# Altium project Internal Power board.PrjPcb
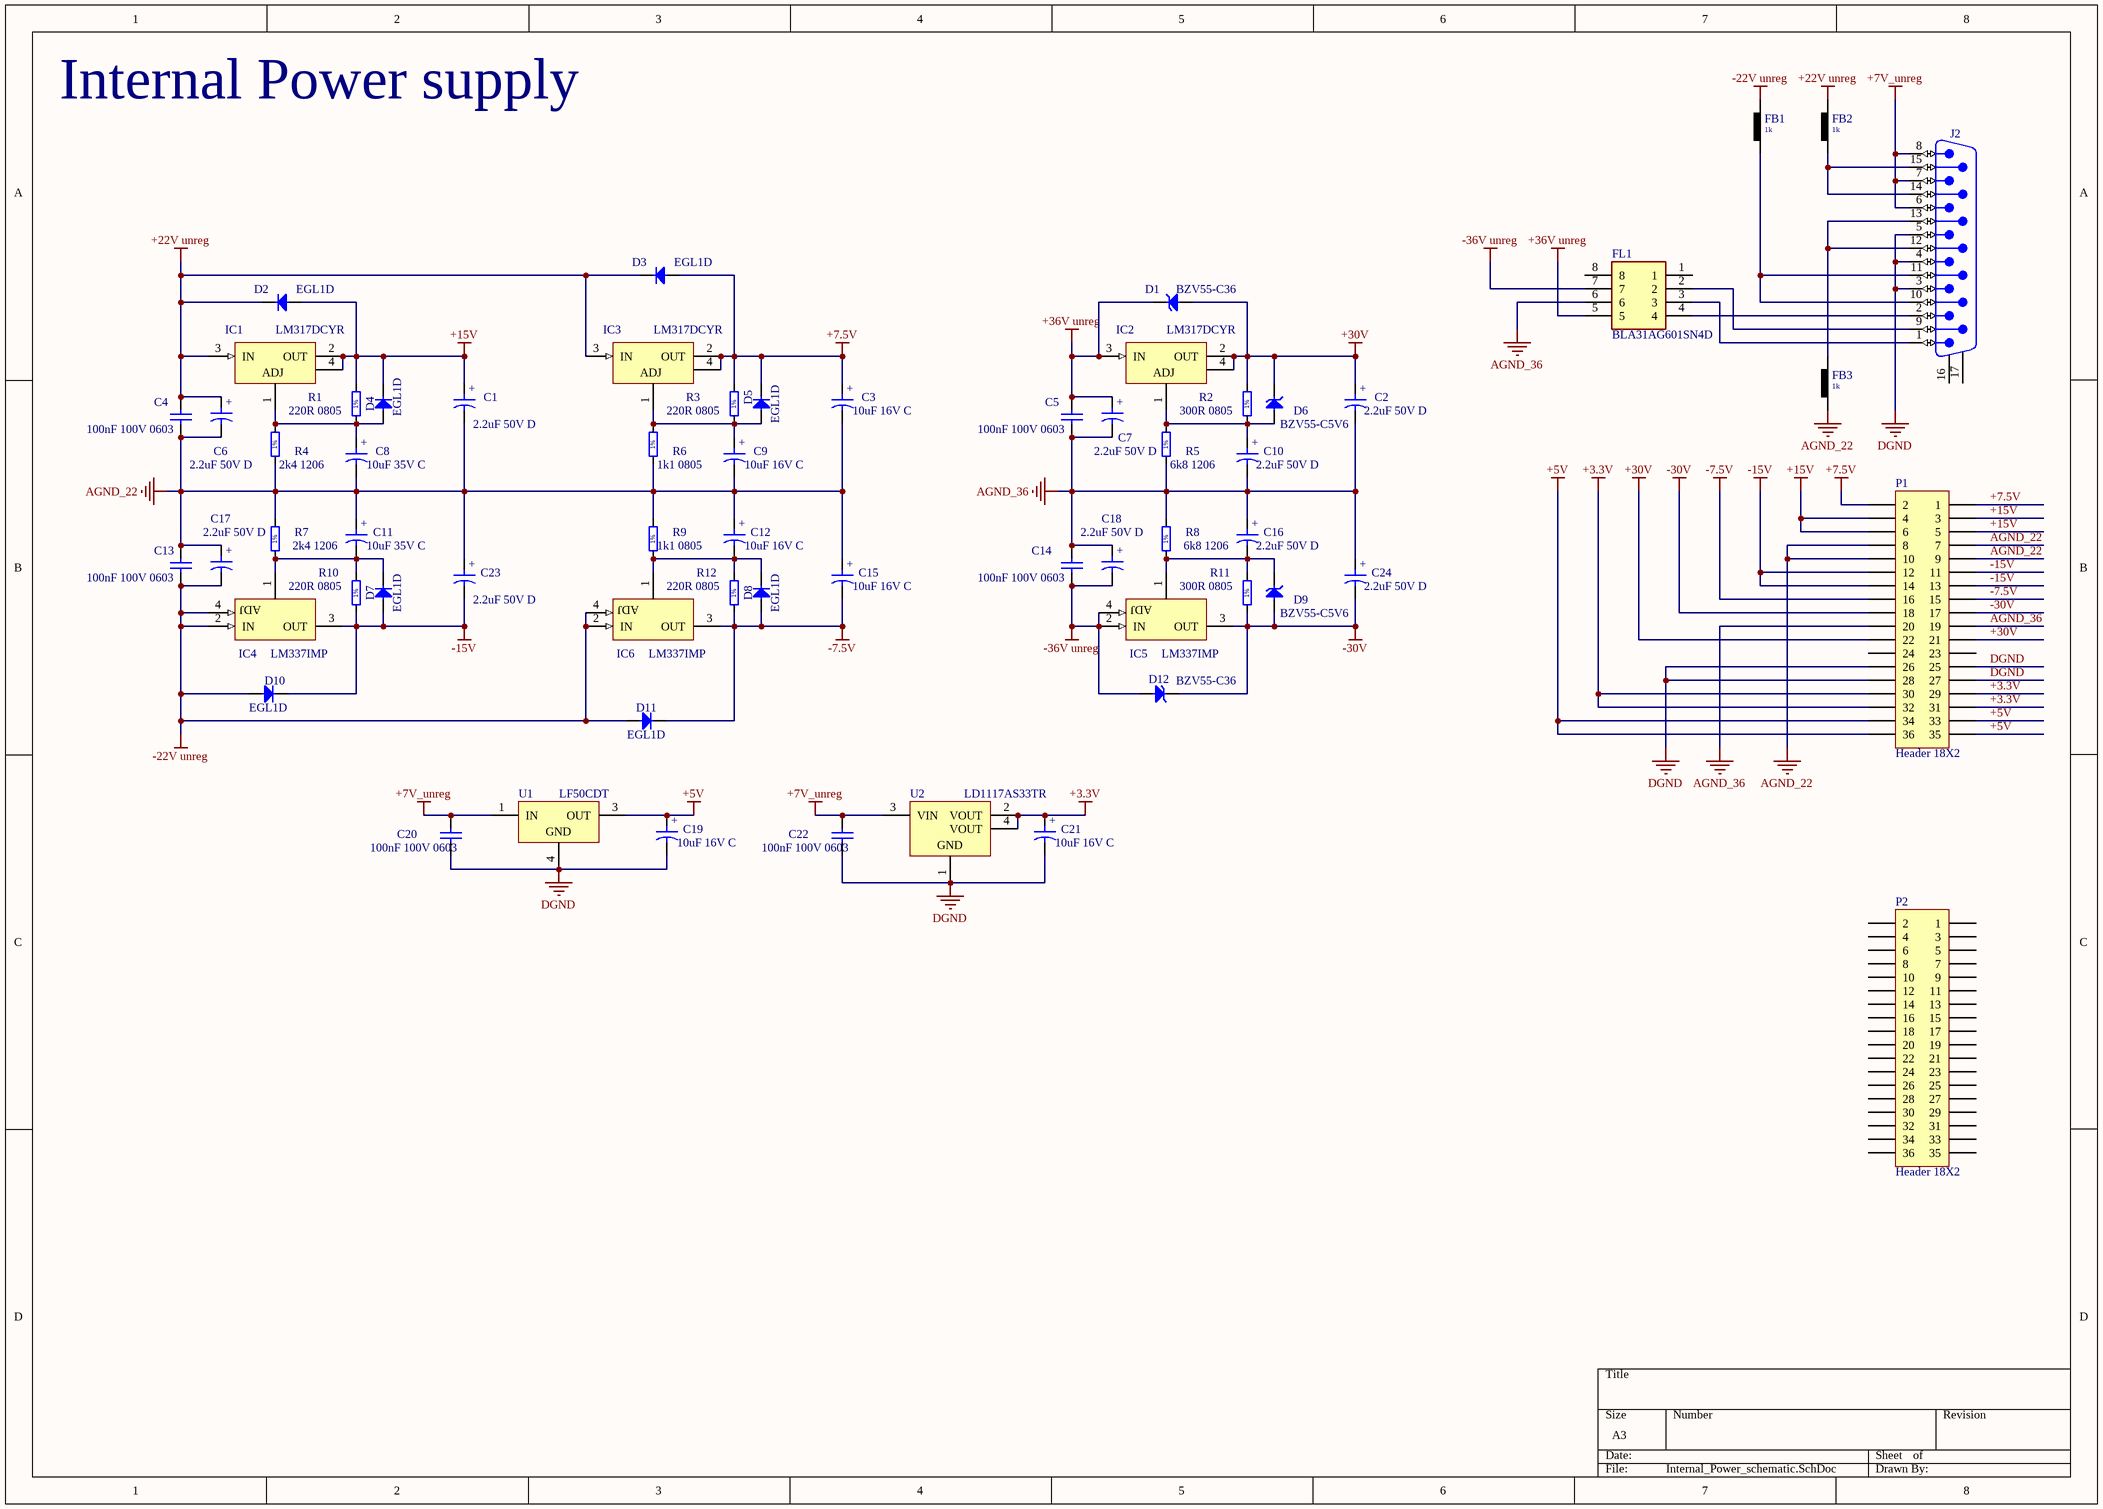
[diagram p0: Internal_Power_schematic.SchDoc]
1 sheet, 63 parts. Net scope: global (net labels, ports and power ports of the same name join across sheets).
Board file: Internal_Power_PCB.PcbDoc

## Sheet Internal_Power_schematic.SchDoc
size A3

### Parts
C1  2.2uF 50V D  [CAPMP7343X310N]
C2  2.2uF 50V D  [CAPMP7343X310N]
C3  10uF 16V C  [CAPMP6032X280N]
C4  100nF 100V 0603  [1608[0603]_CAP]
C5  100nF 100V 0603  [1608[0603]_CAP]
C6  2.2uF 50V D  [CAPMP7343X310N]
C7  2.2uF 50V D  [CAPMP7343X310N]
C8  10uF 35V C  [CAPMP6032X280N]
C9  10uF 16V C  [CAPMP6032X280N]
C10  2.2uF 50V D  [CAPMP7343X310N]
C11  10uF 35V C  [CAPMP6032X280N]
C12  10uF 16V C  [CAPMP6032X280N]
C13  100nF 100V 0603  [1608[0603]_CAP]
C14  100nF 100V 0603  [1608[0603]_CAP]
C15  10uF 16V C  [CAPMP6032X280N]
C16  2.2uF 50V D  [CAPMP7343X310N]
C17  2.2uF 50V D  [CAPMP7343X310N]
C18  2.2uF 50V D  [CAPMP7343X310N]
C19  10uF 16V C  [CAPMP6032X280N]
C20  100nF 100V 0603  [1608[0603]_CAP]
C21  10uF 16V C  [CAPMP6032X280N]
C22  100nF 100V 0603  [1608[0603]_CAP]
C23  2.2uF 50V D  [CAPMP7343X310N]
C24  2.2uF 50V D  [CAPMP7343X310N]
D1  BZV55-C36  [DIOMELF3515N]
D2  EGL1D  [DIOMELF3515N]
D3  EGL1D  [DIOMELF3515N]
D4  EGL1D  [DIOMELF3515N]
D5  EGL1D  [DIOMELF3515N]
D6  BZV55-C5V6  [DIOMELF3515N]
D7  EGL1D  [DIOMELF3515N]
D8  EGL1D  [DIOMELF3515N]
D9  BZV55-C5V6  [DIOMELF3515N]
D10  EGL1D  [DIOMELF3515N]
D11  EGL1D  [DIOMELF3515N]
D12  BZV55-C36  [DIOMELF3515N]
FB1  1k  [FB1206]
FB2  1k  [FB1206]
FB3  1k  [FB1206]
FL1  BLA31AG601SN4D  [BLA31AG102SN4D]
IC1  LM317DCYR  [SOT230P700X180-4N]
IC2  LM317DCYR  [SOT230P700X180-4N]
IC3  LM317DCYR  [SOT230P700X180-4N]
IC4  LM337IMP  [SOT230P700X180-4N]
IC5  LM337IMP  [SOT230P700X180-4N]
IC6  LM337IMP  [SOT230P700X180-4N]
J2  D-Sub  [DB15_PCB_AL;UMINIUM]  (value not drawn)
P1  Header 18X2  [18x2 header aluminium]
P2  Header 18X2  [18x2 header aluminium]
R1  220R 0805  [RESC2012X60N]
R2  300R 0805  [RESC2012X60N]
R3  220R 0805  [RESC2012X60N]
R4  2k4 1206  [RESC3216X65N]
R5  6k8 1206  [RESC3216X65N]
R6  1k1 0805  [RESC2012X60N]
R7  2k4 1206  [RESC3216X65N]
R8  6k8 1206  [RESC3216X65N]
R9  1k1 0805  [RESC2012X60N]
R10  220R 0805  [RESC2012X60N]
R11  300R 0805  [RESC2012X60N]
R12  220R 0805  [RESC2012X60N]
U1  LF50CDT  [TO-252]
U2  LD1117AS33TR  [SOT-223_N]

### Nets
+3.3V: C21.1 P1.29 P1.30 P1.31 P1.32 U2.2(VOUT) U2.4(VOUT)
+5V: C19.1 P1.33 P1.34 P1.35 P1.36 U1.3(OUT)
+7.5V: C3.1 D3.2(A) D5.1(C) IC3.2(OUT) IC3.4(OUT) P1.1 P1.2 R3.2
+7V_unreg: C20.1 C22.1 J2.6 J2.7 J2.8 U1.1(IN) U2.3(VIN)
+15V: C1.1 D2.2(A) D4.1(C) IC1.2(OUT) IC1.4(OUT) P1.3 P1.4 P1.5 P1.6 R1.2
+22V unreg: C4.1 C6.1 D2.1(C) D3.1(C) FB2.2 IC1.3(IN) IC3.3(IN)
+30V: C2.1 D1.2(A) D6.1(C) IC2.2(OUT) IC2.4(OUT) P1.21 P1.22 R2.2
+36V unreg: C5.1 C7.1 D1.1(C) FL1.5 IC2.3(IN)
-7.5V: C15.2 D8.2(A) D11.1(C) IC6.3(OUT) P1.15 P1.16 R12.1
-15V: C23.2 D7.2(A) D10.1(C) IC4.3(OUT) P1.11 P1.12 P1.13 P1.14 R10.1
-22V unreg: C13.2 C17.2 D10.2(A) D11.2(A) FB1.2 IC4.2(IN) IC4.4(IN) IC6.2(IN) IC6.4(IN)
-30V: C24.2 D9.2(A) D12.1(C) IC5.3(OUT) P1.17 P1.18 R11.1
-36V unreg: C14.2 C18.2 D12.2(A) FL1.7 IC5.2(IN) IC5.4(IN)
AGND_22: C1.2 C3.2 C4.2 C6.2 C8.2 C9.2 C11.1 C12.1 C13.1 C15.1 C17.1 C23.1 FB3.1 P1.7 P1.8 P1.9 P1.10 R4.1 R6.1 R7.2 R9.2
AGND_36: C2.2 C5.2 C7.2 C10.2 C14.1 C16.1 C18.1 C24.1 FL1.6 P1.19 P1.20 R5.1 R8.2
DGND: C19.2 C20.2 C21.2 C22.2 J2.3 J2.4 J2.5 P1.25 P1.26 P1.27 P1.28 U1.4(GND) U2.1(GND)
NetC8_1: C8.1 D4.2(A) IC1.1(ADJ) R1.1 R4.2
NetC9_1: C9.1 D5.2(A) IC3.1(ADJ) R3.1 R6.2
NetC10_1: C10.1 D6.2(A) IC2.1(ADJ) R2.1 R5.2
NetC11_2: C11.2 D7.1(C) IC4.1(ADJ) R7.1 R10.2
NetC12_2: C12.2 D8.1(C) IC6.1(ADJ) R9.1 R12.2
NetC16_2: C16.2 D9.1(C) IC5.1(ADJ) R8.1 R11.2
NetFB1_1: FB1.1 J2.10 J2.11
NetFB2_1: FB2.1 J2.14 J2.15
NetFB3_2: FB3.2 J2.12 J2.13
NetFL1_2: FL1.2 J2.9
NetFL1_3: FL1.3 J2.1
NetFL1_4: FL1.4 J2.2

Not connected (* = marked no-connect by the designer): FL1 1 8; J2 16 17; P1 23 24; P2 1 2 3 4 5 6 7 8 9 10 11 12 13 14 15 16 17 18 19 20 21 22 23 24 25 26 27 28 29 30 31 32 33 34 35 36

### Notes on the sheet
- Internal Power supply
- (in symbol CTE6032-28_10UF_25V_10%_LESR0500) +
- (in symbol CTE7343-31_22UF_35V_20%_LESR0400) +
- (in symbol R0805_1K1_1%_0.125W_100PPM) 1%
- (in symbol R0805_220R_1%_0.125W_100PPM) 1%
- (in symbol R1206_2K4_1%_0.25W_100PPM) 1%

### Library data of the parts
C1 C2 C6 C7 C10 C16-C18 C23 C24 = CTE7343-31_22UF_35V_20%_LESR0400: Polarised capacitor; Part Description: Low ESR 0R4 Solid Tantalum Chip Capacitor; Manufacturer: GENERIC; Manufacturer1 Part Number: TPSD226M035R0400; Voltage: 35V; Tolerance: ±20%; Part Number: CTE7343-31_22UF_35V_20%_LESR0400; Component Kind: Standard; Component Type: Standard; Pin Count: 2; Value: 2.2uF 50V D; Status: None; Manufacturer Part Number: CTE7343-31_22UF_35V_20%_LESR0400; Case: D; Mounted: Yes; Socket: No; SMD: Yes; Sense: No; Manufacturer1 Example: AVX; Manufacturer1 ComponentHeight: 3.1mm; HelpURL: \\cern.ch\dfs\Applications\Altium\Datasheets\CTE-LESR_AVX_TPS.pdf; Author: CERN DEM MR; CreateDate: 19.05.2016; LatestRevisionDate: 19.05.2016
C3 C8 C9 C11 C12 C15 C19 C21 = CTE6032-28_10UF_25V_10%_LESR0500: Polarised capacitor; Part Description: Low ESR 0R5 Solid Tantalum Chip Capacitor; Manufacturer: GENERIC; Manufacturer1 Part Number: TPSC106K025R0500; Voltage: 25V; Tolerance: ±10%; Part Number: CTE6032-28_10UF_25V_10%_LESR0500; Component Kind: Standard; Component Type: Standard; Pin Count: 2; Status: Preferred; Manufacturer Part Number: CTE6032-28_10UF_25V_10%_LESR0500; Case: C; Mounted: Yes; Socket: No; SMD: Yes; Sense: No; Manufacturer1 Example: AVX; Manufacturer1 ComponentHeight: 2.8mm; HelpURL: \\cern.ch\dfs\Applications\Altium\Datasheets\CTE-LESR_AVX_TPS.pdf; Author: CERN DEM JLC; CreateDate: 05.05.2008; LatestRevisionDate: 20.01.2009
  C3 C9 C12 C15 C19 C21: Value: 10uF 16V C
  C8 C11: Value: 10uF 35V C
C4 C5 C13 C14 C20 C22 = Cap Semi: Capacitor (Semiconductor SIM Model); Order: GRM31CR71A475KA01L; Published: 8-Jun-2000; LatestRevisionDate: 29-May-2009; LatestRevisionNote: IPC-7351 Footprint Added.; PackageReference: C1206; Publisher: Altium Limited; PackageDescription: Chip Capacitor; Value: 100nF 100V 0603
D1 D6 D9 D12 = BZV55-C12: Zener Diode; Part Description: Voltage Regulator Diode; Manufacturer: NXP SEMICONDUCTORS; Voltage: 12V; Power: 500mW; PressFit: No; Bonding: No; Part Number: BZV55-C12; Component Kind: Standard; Component Type: Standard; PackageDescription: SOD80C, MELF Diode, 2-Leads, Body 3.5x1.5mm, IPC Medium Density; Manufacturer Part Number: BZV55-C12; Pin Count: 2; Case: SOD-80C; Mounted: Yes; Socket: No; SMD: Yes; Sense: No; ComponentHeight: 1.6mm; HelpURL: \\cern.ch\dfs\Applications\Altium\Datasheets\BZV55.pdf; Author: CERN DEM MR; CreateDate: 19.05.2016; LatestRevisionDate: 19.05.2016
  D1 D12: Device: BZV55-C36
  D6 D9: Device: BZV55-C5V6
D2-D5 D7 D8 D10 D11 = PMLL4148L: Diode; Part Description: High-speed switching diodes; Manufacturer: NXP SEMICONDUCTORS; Voltage: 75V; Power: 200mA; PressFit: No; Bonding: No; Part Number: PMLL4148L; Component Kind: Standard; Component Type: Standard; Device: EGL1D; PackageDescription: SOD80C, MELF Diode, 2-Leads, Body 3.5x1.5mm, IPC Medium Density; Status: Not recommended; Manufacturer Part Number: PMLL4148L; Pin Count: 2; Case: SOD-80C; Mounted: Yes; Socket: No; SMD: Yes; Sense: No; ComponentHeight: 1.6mm; HelpURL: \\cern.ch\dfs\Applications\Altium\Datasheets\PMLL4148L.pdf; Author: CERN DEM JLC; CreateDate: 30.03.2009; LatestRevisionDate: 09.12.2009
FB1-FB3 = Chip FB BLM31P: 1206 1.5A 0.08ohm; Value: 1u; Price: 0.16
FL1 = BLA31AG601SN4D: Filter; Manufacturer_Name: Murata Electronics; Datasheet Link: https://www.murata.com/en-us/products/productdetail?partno=BLA31AG601SN4%23; Height: 1mm; Manufacturer_Part_Number: BLA31AG601SN4D; Mouser Part Number: 81-BLA3216A601SG4; Mouser Price/Stock: https://www.mouser.co.uk/ProductDetail/Murata-Electronics/BLA31AG601SN4D?qs=2ahBf5rJw09FDcUVkQibEg%3D%3D; Arrow Part Number: BLA31AG601SN4D; Arrow Price/Stock: https://www.arrow.com/en/products/bla31ag601sn4d/murata-manufacturing
IC1-IC3 = LM317EMP: 3-Terminal Regulator 1=Adj 2=OUT 3=IN 4=OUT; Part Description: 3-Terminal 1.2V To 37V 1A Positive Adjustable Regulator; Manufacturer: TEXAS INSTRUMENTS; PressFit: No; Bonding: No; Part Number: LM317EMP; Component Kind: Standard; Component Type: Standard; Device: LM317DCYR; PackageDescription: SOT223, 2.30mm pitch; 3 pin, 3.70mm W X 6.70mm L, IPC Medium Density; Status: Not Recommended; Manufacturer Part Number: LM317EMP; Pin Count: 4; Case: SOT-223; Mounted: Yes; Socket: No; SMD: Yes; Sense: No; ComponentHeight: 1.8mm; HelpURL: \\cern.ch\dfs\Applications\Altium\Datasheets\LM317EMP.pdf; Author: CERN DEM JLC; CreateDate: 02.12.2008; LatestRevisionDate: 16.09.2014
IC4-IC6 = LM337IMP/NOPB: 3-Terminal Regulator 1=Adj 2=IN 3=OUT 4=IN; Part Description: 3-Terminal -1.2V To -37V 1A Adjustable Negative Regulator; Manufacturer: TEXAS INSTRUMENTS; PressFit: No; Bonding: No; Part Number: LM337IMP/NOPB; Component Kind: Standard; Component Type: Standard; Device: LM337IMP; PackageDescription: SOT223, 2.30mm pitch; 3 pin, 3.70mm W X 6.70mm L, IPC Medium Density; Manufacturer Part Number: LM337IMP/NOPB; Pin Count: 4; Case: SOT-223; Mounted: Yes; Socket: No; SMD: Yes; Sense: No; ComponentHeight: 1.8mm; HelpURL: \\cern.ch\dfs\Applications\Altium\Datasheets\LM337IMP-NOPB.pdf; Author: CERN DEM JLC; CreateDate: 31.08.2010; LatestRevisionDate: 21.09.2015
J2 = AMPHENOL_L117DFA15P1ATN: Connector D-sub 15 Male; Part Description: Right Angled D-Sub 15 Male Contacts with Metal Bracket and Front Female Screwlock (UNC4-40); Manufacturer Part Number: L717DFA15P1ATN; PressFit: No; Part Number: AMPHENOL_L117DFA15P1ATN; Component Kind: Standard; Component Type: Standard; Footprint: AMPHENOL_L717DFA15P1ATN; Pin Count: 17; Family: D-Sub; Mounted: Yes; Socket: No; SMD: No; Sense: No; Status: None; Manufacturer: AMPHENOL; ComponentHeight: 13.4mm; HelpURL: \\cern.ch\dfs\Applications\Altium\Datasheets\AMPHENOL_L717DFA15P1ATN.pdf; Author: CERN DEM JLC; CreateDate: 05.05.2009; LatestRevisionDate: 14.07.2011; System: Connector
P1 P2 = Header 18X2: Header, 18-Pin, Dual row; System: Connector; LatestRevisionDate: 17-Jul-2002; LatestRevisionNote: Re-released for DXP Platform.; Publisher: Altium Limited
R1-R3 R10-R12 = R0805_220R_1%_0.125W_100PPM: Resistor - 1%; Part Description: General Purpose Thick Film Chip Resistor; Manufacturer: GENERIC; Manufacturer1 Part Number: NRC10F2200TRF; Power: 0.125W; TC: ±100ppm/°C; PressFit: No; Part Number: R0805_220R_1%_0.125W_100PPM; Component Kind: Standard; Component Type: Standard; Pin Count: 2; Status: Preferred; Tolerance: ±1%; Manufacturer Part Number: R0805_220R_1%_0.125W_100PPM; Case: 0805; Mounted: Yes; Sense: No; Socket: No; SMD: Yes; Manufacturer1 Example: NIC COMPONENT; Manufacturer1 ComponentHeight: 0.6mm; HelpURL: \\cern.ch\dfs\Applications\Altium\Datasheets\R0805_NIC_NRC.pdf; Author: CERN DEM JLC; CreateDate: 03.12.2007; LatestRevisionDate: 13.03.2008
  R1 R3 R10 R12: Value: 220R 0805
  R2 R11: Value: 300R 0805
R4 R5 R7 R8 = R1206_2K4_1%_0.25W_100PPM: Resistor - 1%; Part Description: General Purpose Thick Film Chip Resistor; Manufacturer: GENERIC; Manufacturer1 Part Number: NRC12F2401TRF; Power: 0.25W; TC: ±100ppm/°C; PressFit: No; Part Number: R1206_2K4_1%_0.25W_100PPM; Component Kind: Standard; Component Type: Standard; Pin Count: 2; Status: Preferred; Tolerance: ±1%; Manufacturer Part Number: R1206_2K4_1%_0.25W_100PPM; Case: 1206; Mounted: Yes; Sense: No; Socket: No; SMD: Yes; Manufacturer1 Example: NIC COMPONENT; Manufacturer1 ComponentHeight: 0.65mm; HelpURL: \\cern.ch\dfs\Applications\Altium\Datasheets\R1206_NIC_NRC.pdf; Author: CERN DEM JLC; CreateDate: 03.12.2007; LatestRevisionDate: 13.03.2008
  R4 R7: Value: 2k4 1206
  R5 R8: Value: 6k8 1206
R6 R9 = R0805_1K1_1%_0.125W_100PPM: Resistor - 1%; Part Description: General Purpose Thick Film Chip Resistor; Manufacturer: GENERIC; Manufacturer1 Part Number: NRC10F1101TRF; Power: 0.125W; TC: ±100ppm/°C; PressFit: No; Part Number: R0805_1K1_1%_0.125W_100PPM; Component Kind: Standard; Component Type: Standard; Pin Count: 2; Value: 1k1 0805; Status: Preferred; Tolerance: ±1%; Manufacturer Part Number: R0805_1K1_1%_0.125W_100PPM; Case: 0805; Mounted: Yes; Sense: No; Socket: No; SMD: Yes; Manufacturer1 Example: NIC COMPONENT; Manufacturer1 ComponentHeight: 0.6mm; HelpURL: \\cern.ch\dfs\Applications\Altium\Datasheets\R0805_NIC_NRC.pdf; Author: CERN DEM JLC; CreateDate: 03.12.2007; LatestRevisionDate: 13.03.2008
U1 = LF50CDT: 500mA, Very Low Drop (0.45V) Voltage Regulator; Published: 24-Aug-2001; LatestRevisionDate: 06-Jun-2005; LatestRevisionNote: PCB pads lengthened.; DatasheetVersion: Feb-2004; PackageVersion: Jun-2004; PackageReference: TO-252; Publisher: Altium Limited; PackageDescription: D-PAK/TO-252-AA; 3 Leads (1 Cropped); Body 10.1 (inc. leads) x 6.6 mm (LxW max); ComponentLink1Description: Manufacturer Link; ComponentLink1URL: http://www.st.com/; ComponentLink2Description: Datasheet; ComponentLink2URL: http://www.st.com/stonline/books/pdf/docs/2574.pdf
U2 = LD1117AS33TR: 1A, Low Drop Positive Voltage Regulator, 3.3V, 4-Pin SOT-223, Tape and Reel; DatasheetVersion: Dec-2011; PackageVersion: 2010; PackageReference: SOT-223; PackageDescription: 4-Pin SOT-223 Package, 6.5 x 3.5 mm Body, 2.3 mm Pitch, 7 mm Lead Span; PartNumber: LD1117AS33TR; ComponentLink1Description: Manufacturer URL; ComponentLink1URL: http://www.st.com; ComponentLink2Description: Datasheet; ComponentLink2URL: http://www.st.com/internet/com/TECHNICAL_RESOURCES/TECHNICAL_LITERATURE/DATASHEET/CD00002116.pdf